# Altium schematic sheet BMI270.SchDoc
size Letter; SheetNumber: 4; SheetTotal: 4
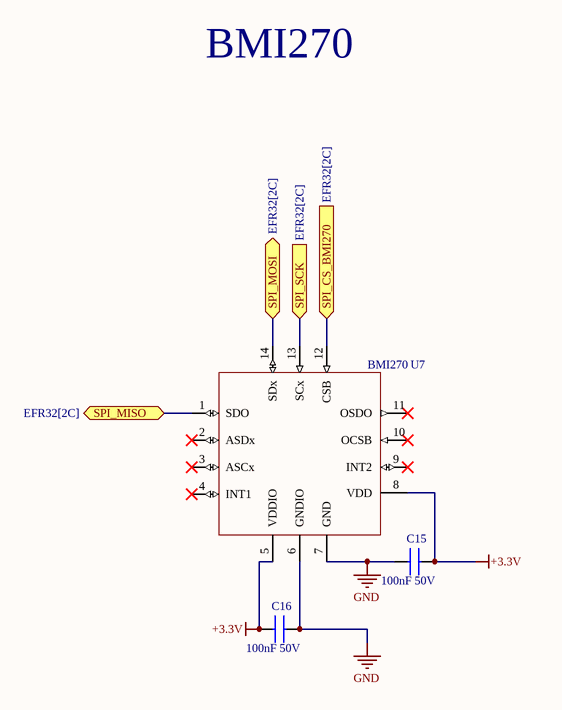
[diagram p0: BMI270.SchDoc]

## Parts
C15  100nF 50V  [CAP_0603_1MM]
C16  100nF 50V  [CAP_0603_1MM]
U7  BMI270  [14-QFN_3x2.5_BMI270]

## Ports
SPI_CS_BMI270 (in, see EFR32[2C]), SPI_MISO (bidir, see EFR32[2C]), SPI_MOSI (bidir, see EFR32[2C]), SPI_SCK (in, see EFR32[2C])

## Nets
+3.3V: C15.1 C16.2 U7.5(VDDIO) U7.8(VDD)
GND: C15.2 C16.1 U7.6(GNDIO) U7.7(GND)
SPI_CS_BMI270: U7.12(CSB) ; port SPI_CS_BMI270
SPI_MISO: U7.1(SDO) ; port SPI_MISO
SPI_MOSI: U7.14(SDx) ; port SPI_MOSI
SPI_SCK: U7.13(SCx) ; port SPI_SCK

Not connected (* = marked no-connect by the designer): U7 2(ASDx)* 3(ASCx)* 4(INT1)* 9(INT2)* 10(OCSB)* 11(OSDO)*

## Notes on the sheet
- BMI270

## Library data of the parts
C15 C16 = CC_0.1uF_0603_ZRY5V9BB104: Ceramic Capacitor, Multilayer, Ceramic, 50V, 80% +Tol, 20% -Tol, Y5V, -82/+22% TC, 0.1uF, Surface Mount, 0603; Manufacturer: Yageo; Manufacturer Part Number: CC0603ZRY5V9BB104; Multilayer: Yes; Supplier: Digikey; Supplier Part Number: 311-1343-1-ND; RoHS: Yes; Category: Ceramic Capacitors; Stock: 7870307; Pricing: 1=0.1, 10=0.028, 50=0.0162, 100=0.0125, 500=0.00944, 1000=0.00742 (USD); Mounting Technology: Surface Mount; Pins: 2; Dielectric Material: Ceramic; Package Shape: Rectangular; Case/Package: 0603; Terminal Finish: Nickel; Min Operating Temperature: -30°C; Max Operating Temperature: 85°C; JESD-609 Code: e3; Value: 100nF; Capacitor Type: Ceramic; Tolerance  (fill in as +-): 20%; Package Style: SMTMeter; Packaging: Tape and Reel; Tolerance (fill in as +-): 80%; Rated DC Voltage (URdc): 50V; Temperature Characteristics Code: Y5V; Termination: Wraparound; Length: 1.6mm; Width: 0.8mm; Height: 0.8mm; Reach SVHC Compliant: Yes; RoHS Compliant: Yes; ComponentLink1URL: https://datasheet.ciiva.com:443/pdfs/VipMasterIC/IC/YAGO/YAGO-S-A0004841839/YAGO-S-A0004841839-1.pdf?src-supplier=IHS+Markit; ComponentLink1Description: https://datasheet.ciiva.com:443/pdfs/VipMasterIC/IC/YAGO/YAGO-S-A0004841839/YAGO-S-A0004841839-1.pdf?src-supplier=IHS+Markit; ComponentLink2URL: https://datasheet.ciiva.com/144/mlccorderingcode-144027.pdf?src-supplier=Digikey; ComponentLink2Description: https://datasheet.ciiva.com/144/mlccorderingcode-144027.pdf?src-supplier=Digikey; ComponentLink3URL: https://datasheet.ciiva.com/11786/0900766b8079c870-11786029.pdf?src-supplier=Rs; ComponentLink3Description: https://datasheet.ciiva.com/11786/0900766b8079c870-11786029.pdf?src-supplier=Rs; ComponentLink4URL: https://datasheet.ciiva.com/144/mlccorderingcode-144025.pdf?src-supplier=Digikey; ComponentLink4Description: https://datasheet.ciiva.com/144/mlccorderingcode-144025.pdf?src-supplier=Digikey; ComponentLink5URL: https://datasheet.ciiva.com/144/mlccorderingcode-144026.pdf?src-supplier=Digikey; ComponentLink5Description: https://datasheet.ciiva.com/144/mlccorderingcode-144026.pdf?src-supplier=Digikey; ComponentLink6URL: https://datasheet.ciiva.com/5427/upy-gphc-y5v-6-3v-to-50v-5-5427420.pdf?src-supplier=Mouser; ComponentLink6Description: https://datasheet.ciiva.com/5427/upy-gphc-y5v-6-3v-to-50v-5-5427420.pdf?src-supplier=Mouser; ComponentLink7URL: https://datasheet.ciiva.com/28450/1132289-28450702.pdf?src-supplier=Element14; ComponentLink7Description: https://datasheet.ciiva.com/28450/1132289-28450702.pdf?src-supplier=Element14; ComponentLink8URL: https://datasheet.ciiva.com/26829/getdatasheetpartid-403611-26829467.pdf?src-supplier=Verical; ComponentLink8Description: https://datasheet.ciiva.com/26829/getdatasheetpartid-403611-26829467.pdf?src-supplier=Verical
U7 = BMI270: BMI270 Series 3.6 V 685 µA Smart Ultra-low Power Inertial Measurement Unit; Manufacturer: Bosch Tools; Supplier: Digikey; Supplier Part Number: 828-1091-1-ND; Manufacturer Part Number: BMI270; RoHS: No; Category: Linear ICs; Stock: 6145; Pricing: 1=5.88, 10=4.409, 25=3.9188, 50=3.7228, 100=3.6249, 500=3.03708, 1000=2.84113, 5000=2.64519 (USD)